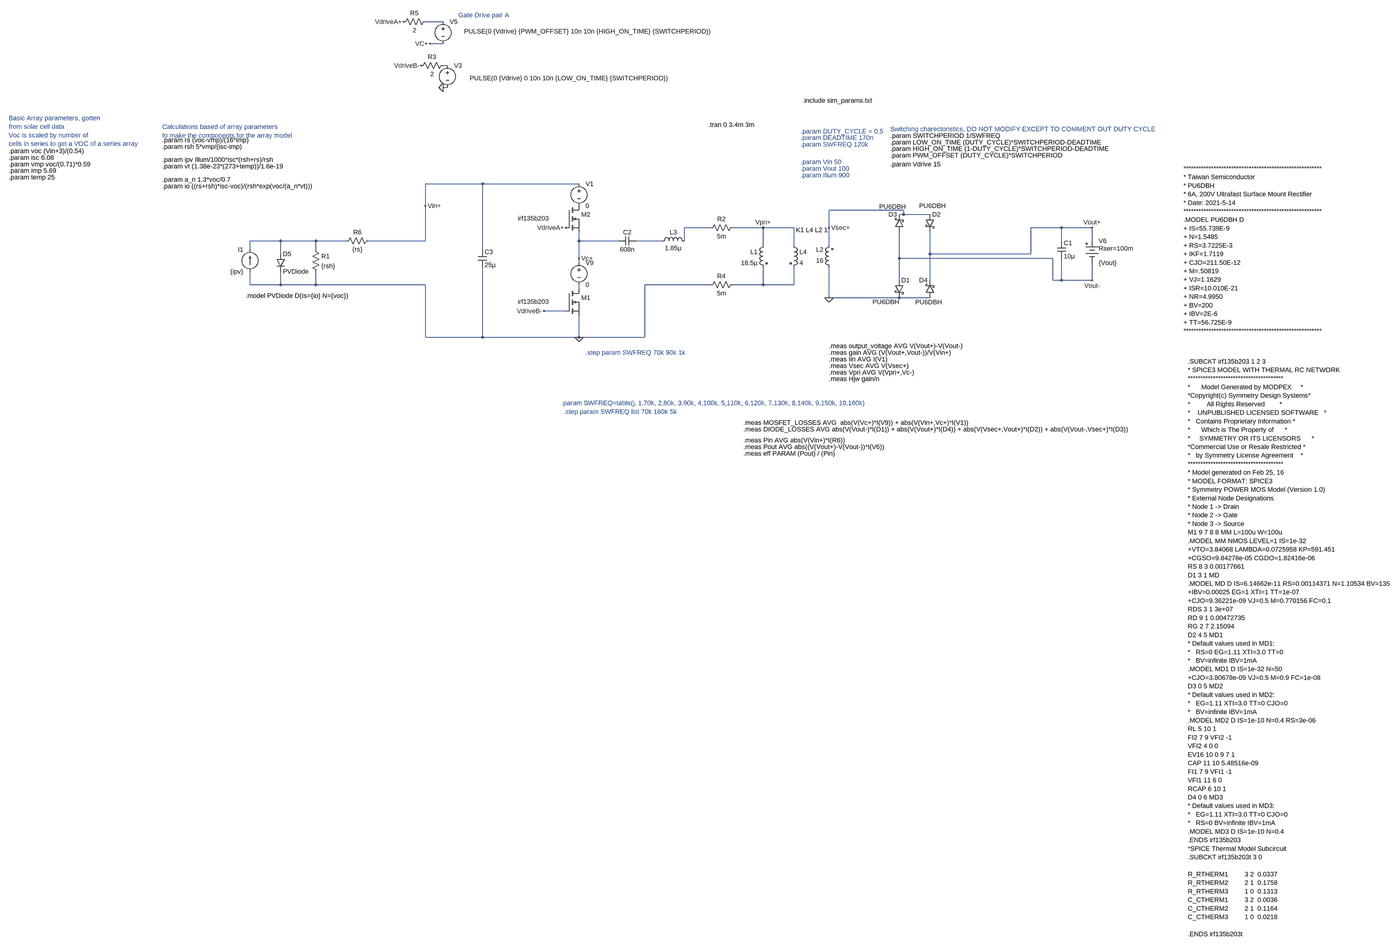
[diagram p0: schematic resonant_half_bridge.asc, whole sheet]
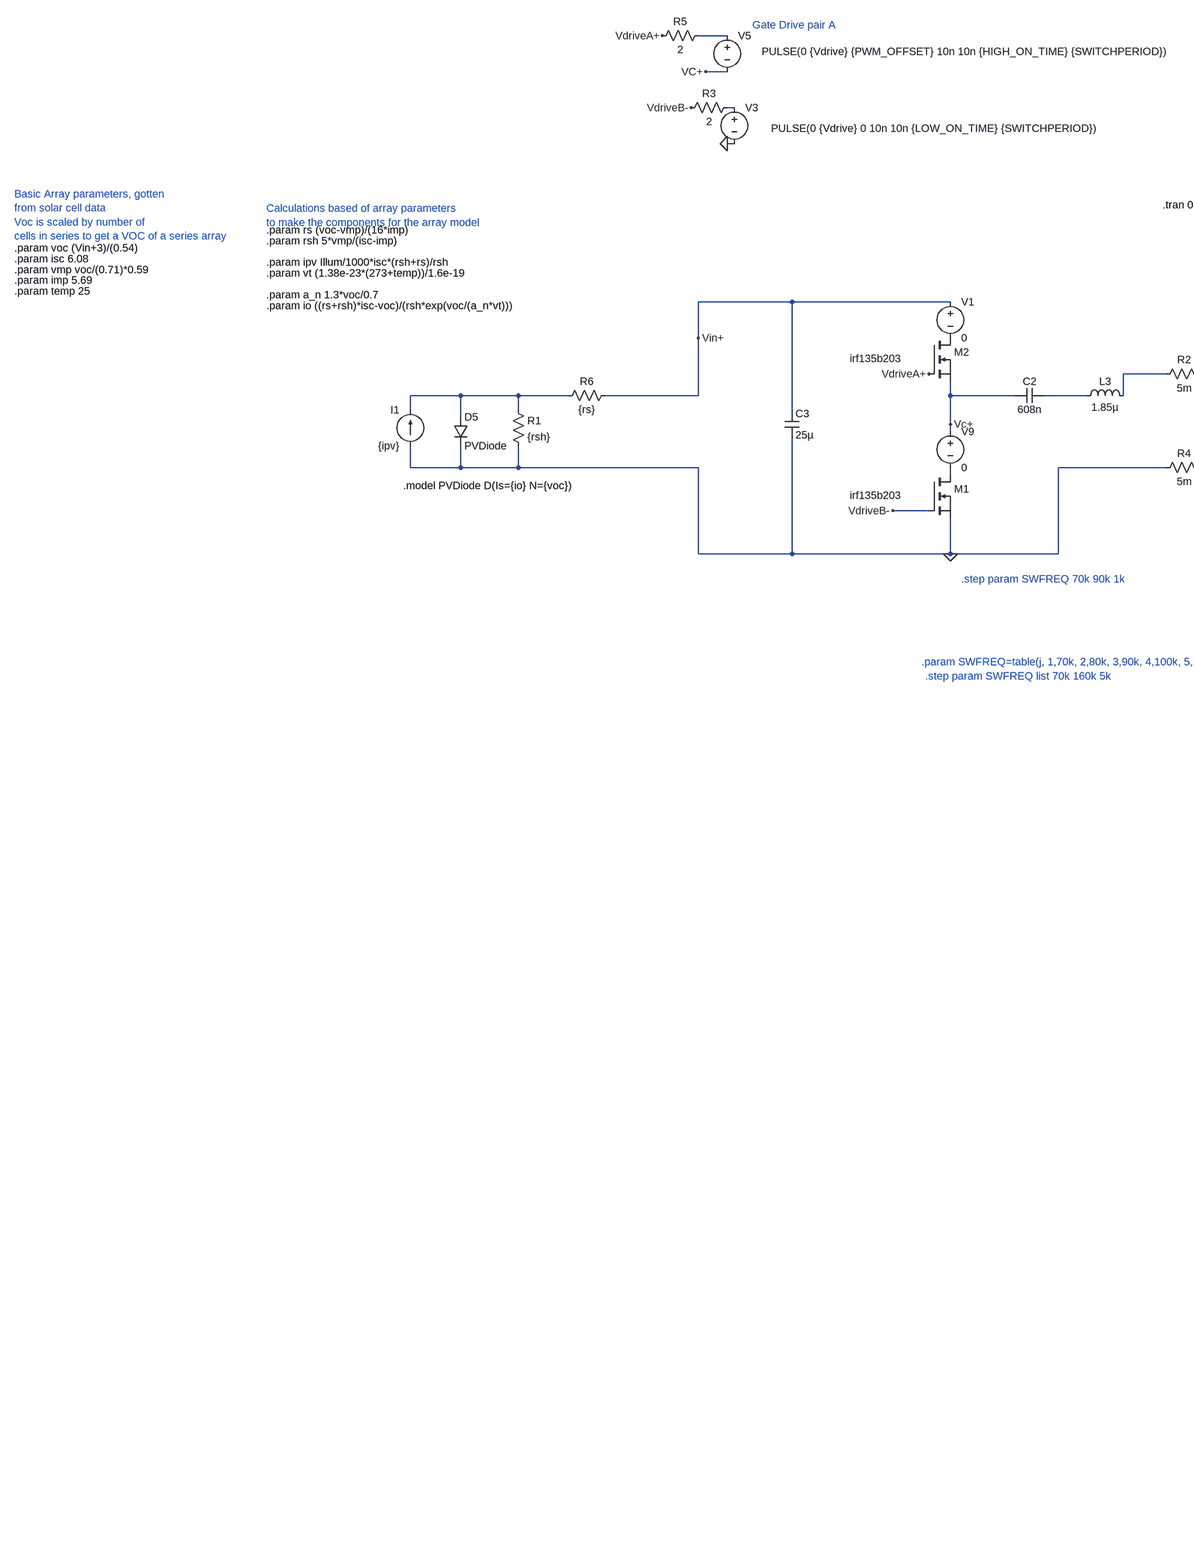
[diagram p1: schematic resonant_half_bridge.asc, part, row 1 of 1, column 1 of 2]
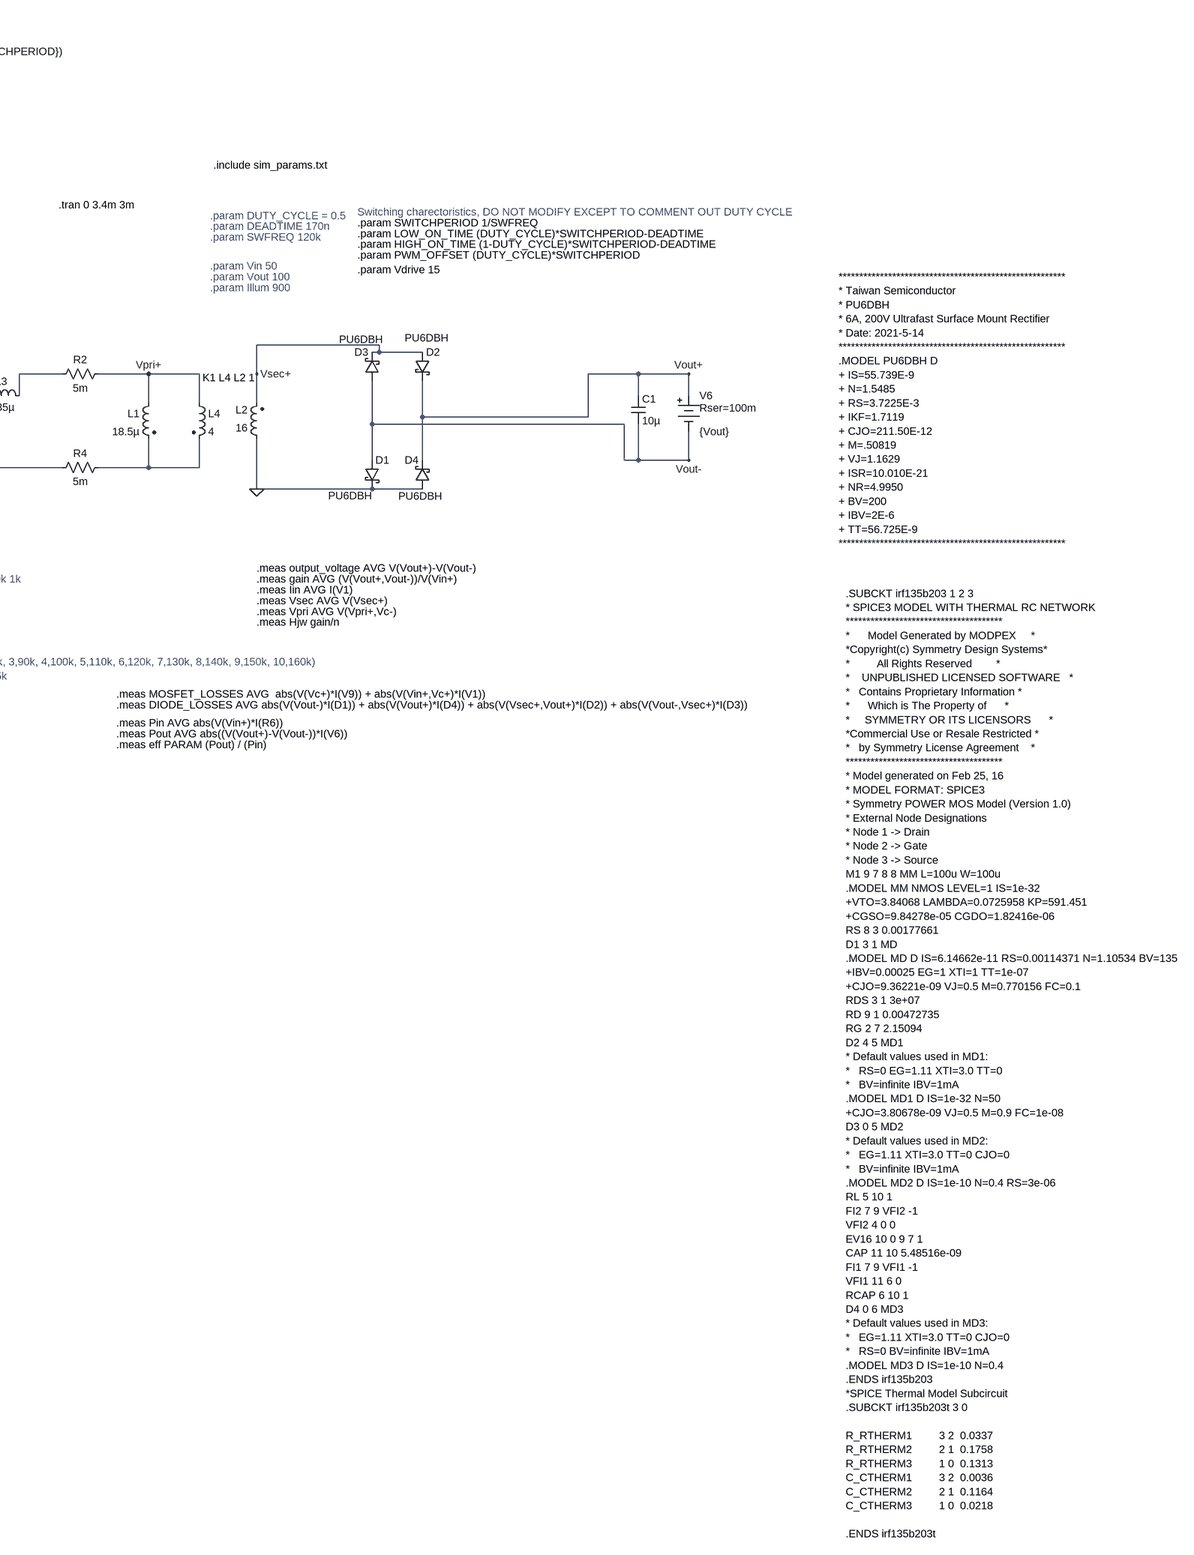
[diagram p2: schematic resonant_half_bridge.asc, part, row 1 of 1, column 2 of 2]
resonant_half_bridge.asc, the LTspice schematic file:
Version 4
SHEET 1 2776 1356
WIRE -1456 -1776 -1520 -1776
WIRE -1456 -1696 -1504 -1696
WIRE -1440 -1616 -1456 -1616
WIRE -1440 -1536 -1456 -1536
WIRE -1312 -1184 -1520 -1184
WIRE -960 -1184 -1312 -1184
WIRE -1520 -1104 -1520 -1184
WIRE 224 -1088 -48 -1088
WIRE 224 -1072 224 -1088
WIRE 224 -1072 208 -1072
WIRE 320 -1072 224 -1072
WIRE -480 -1024 -576 -1024
WIRE -288 -1024 -400 -1024
WIRE -176 -1024 -288 -1024
WIRE -48 -1024 -48 -1088
WIRE 800 -1024 688 -1024
WIRE 912 -1024 800 -1024
WIRE -2048 -976 -2160 -976
WIRE -1920 -976 -2048 -976
WIRE -1808 -976 -1920 -976
WIRE -1520 -976 -1520 -1104
WIRE -1520 -976 -1728 -976
WIRE -960 -976 -960 -1008
WIRE -816 -976 -960 -976
WIRE -656 -976 -752 -976
WIRE -576 -976 -576 -1024
WIRE 800 -976 800 -1024
WIRE 912 -976 912 -1024
WIRE -288 -960 -288 -1024
WIRE -176 -960 -176 -1024
WIRE -48 -960 -48 -1024
WIRE -2160 -944 -2160 -976
WIRE -1920 -944 -1920 -976
WIRE -1312 -944 -1312 -1184
WIRE -2048 -928 -2048 -976
WIRE 320 -928 320 -1008
WIRE 688 -928 688 -1024
WIRE 688 -928 320 -928
WIRE -960 -912 -960 -976
WIRE 208 -912 208 -1008
WIRE 768 -912 208 -912
WIRE -960 -896 -960 -912
WIRE 208 -832 208 -912
WIRE 320 -832 320 -928
WIRE 768 -832 768 -912
WIRE 800 -832 800 -912
WIRE 800 -832 768 -832
WIRE 912 -832 912 -896
WIRE 912 -832 800 -832
WIRE -2160 -816 -2160 -864
WIRE -2048 -816 -2048 -864
WIRE -2048 -816 -2160 -816
WIRE -1920 -816 -1920 -864
WIRE -1920 -816 -2048 -816
WIRE -1520 -816 -1920 -816
WIRE -480 -816 -720 -816
WIRE -288 -816 -288 -880
WIRE -288 -816 -400 -816
WIRE -176 -816 -176 -880
WIRE -176 -816 -288 -816
WIRE -960 -800 -960 -816
WIRE -48 -768 -48 -880
WIRE 208 -768 -48 -768
WIRE 320 -768 208 -768
WIRE -1008 -720 -1088 -720
WIRE -1520 -624 -1520 -816
WIRE -1312 -624 -1312 -880
WIRE -1312 -624 -1520 -624
WIRE -960 -624 -960 -704
WIRE -960 -624 -1312 -624
WIRE -720 -624 -720 -816
WIRE -720 -624 -960 -624
FLAG -48 -768 0
FLAG -1520 -1104 Vin+
FLAG 912 -1024 Vout+
FLAG 912 -832 Vout-
FLAG -960 -912 Vc+
FLAG -1008 -1024 VdriveA+
FLAG -1088 -720 VdriveB-
FLAG -1456 -1536 0
FLAG -1504 -1696 VC+
FLAG -1600 -1776 VdriveA+
FLAG -1536 -1616 VdriveB-
FLAG -48 -1024 Vsec+
FLAG -288 -1024 Vpri+
FLAG -960 -624 0
SYMBOL nmos -1008 -1104 R0
WINDOW 3 -175 46 Left 2
SYMATTR Value irf135b203
SYMATTR InstName M2
SYMATTR Prefix X
SYMBOL cap 784 -976 R0
SYMATTR InstName C1
SYMATTR Value 10µ
SYMBOL cap -816 -960 R270
WINDOW 0 32 32 VTop 2
WINDOW 3 0 32 VBottom 2
SYMATTR InstName C2
SYMATTR Value 608n
SYMBOL ind2 -272 -976 M0
SYMATTR InstName L1
SYMATTR Value 18.5µ
SYMATTR Type ind
SYMBOL ind2 -32 -864 R180
WINDOW 0 36 80 Left 2
WINDOW 3 36 40 Left 2
SYMATTR InstName L2
SYMATTR Value 16
SYMATTR Type ind
SYMBOL ind -672 -960 R270
WINDOW 0 32 56 VTop 2
WINDOW 3 5 56 VBottom 2
SYMATTR InstName L3
SYMATTR Value 1.85µ
SYMBOL voltage -1440 -1632 R0
WINDOW 3 82 62 Left 2
WINDOW 123 0 0 Left 0
WINDOW 39 0 0 Left 0
SYMATTR Value PULSE(0 {Vdrive} 0 10n 10n {LOW_ON_TIME} {SWITCHPERIOD})
SYMATTR InstName V3
SYMBOL nmos -1008 -800 R0
WINDOW 3 -175 46 Left 2
SYMATTR Value irf135b203
SYMATTR InstName M1
SYMATTR Prefix X
SYMBOL voltage -1456 -1792 R0
WINDOW 3 77 51 Left 2
WINDOW 123 0 0 Left 0
WINDOW 39 0 0 Left 0
SYMATTR Value PULSE(0 {Vdrive} {PWM_OFFSET} 10n 10n {HIGH_ON_TIME} {SWITCHPERIOD})
SYMATTR InstName V5
SYMBOL schottky 224 -1008 R180
WINDOW 3 -8 93 Left 2
WINDOW 0 24 64 Left 2
SYMATTR Value PU6DBH
SYMATTR InstName D3
SYMATTR Description Diode
SYMATTR Type diode
SYMATTR SpiceLine Bv=200
SYMBOL schottky 192 -832 R0
WINDOW 3 75 80 Left 2
SYMATTR Value PU6DBH
SYMATTR InstName D1
SYMATTR Description Diode
SYMATTR Type diode
SYMATTR SpiceLine Bv=200
SYMBOL schottky 304 -1072 R0
WINDOW 3 -23 -32 Left 2
SYMATTR Value PU6DBH
SYMATTR InstName D2
SYMATTR Description Diode
SYMATTR Type diode
SYMATTR SpiceLine Bv=200
SYMBOL schottky 336 -768 R180
WINDOW 3 128 -15 Left 2
WINDOW 0 24 64 Left 2
SYMATTR Value PU6DBH
SYMATTR InstName D4
SYMATTR Description Diode
SYMATTR Type diode
SYMATTR SpiceLine Bv=200
SYMBOL res -1440 -1632 R90
WINDOW 0 0 56 VBottom 2
WINDOW 3 32 56 VTop 2
SYMATTR InstName R3
SYMATTR Value 2
SYMBOL res -1504 -1792 R90
WINDOW 0 0 56 VBottom 2
WINDOW 3 32 56 VTop 2
SYMATTR InstName R5
SYMATTR Value 2
SYMBOL Misc\\battery 912 -992 R0
WINDOW 123 0 0 Left 0
WINDOW 39 24 44 Left 2
SYMATTR SpiceLine Rser=100m
SYMATTR InstName V6
SYMATTR Value {Vout}
SYMBOL res -1936 -960 R0
SYMATTR InstName R1
SYMATTR Value {rsh}
SYMBOL res -1824 -960 R270
WINDOW 0 32 56 VTop 2
WINDOW 3 0 56 VBottom 2
SYMATTR InstName R6
SYMATTR Value {rs}
SYMBOL current -2160 -864 R180
WINDOW 0 24 80 Left 2
WINDOW 3 24 0 Left 2
WINDOW 123 0 0 Left 0
WINDOW 39 0 0 Left 0
SYMATTR InstName I1
SYMATTR Value {ipv}
SYMBOL diode -2064 -928 R0
SYMATTR InstName D5
SYMATTR Value PVDiode
SYMBOL cap -1328 -944 R0
SYMATTR InstName C3
SYMATTR Value 25µ
SYMBOL voltage -960 -1200 R0
WINDOW 123 0 0 Left 0
WINDOW 39 0 0 Left 0
SYMATTR InstName V1
SYMATTR Value 0
SYMBOL voltage -960 -912 R0
WINDOW 123 0 0 Left 0
WINDOW 39 0 0 Left 0
SYMATTR InstName V9
SYMATTR Value 0
SYMBOL ind2 -192 -976 R0
SYMATTR InstName L4
SYMATTR Value 4
SYMATTR Type ind
SYMBOL res -496 -1008 R270
WINDOW 0 32 56 VTop 2
WINDOW 3 0 56 VBottom 2
SYMATTR InstName R2
SYMATTR Value 5m
SYMBOL res -384 -832 R90
WINDOW 0 0 56 VBottom 2
WINDOW 3 32 56 VTop 2
SYMATTR InstName R4
SYMATTR Value 5m
TEXT -152 -1352 Left 2 ;.param DEADTIME 170n
TEXT -152 -1328 Left 2 ;.param SWFREQ 120k
TEXT 176 -1360 Left 2 !.param SWITCHPERIOD 1/SWFREQ
TEXT 176 -1336 Left 2 !.param LOW_ON_TIME (DUTY_CYCLE)*SWITCHPERIOD-DEADTIME
TEXT 176 -1312 Left 2 !.param HIGH_ON_TIME (1-DUTY_CYCLE)*SWITCHPERIOD-DEADTIME
TEXT 176 -1288 Left 2 !.param PWM_OFFSET (DUTY_CYCLE)*SWITCHPERIOD
TEXT -152 -1264 Left 2 ;.param Vin 50
TEXT -152 -1376 Left 2 ;.param DUTY_CYCLE = 0.5
TEXT 176 -1384 Left 2 ;Switching charectoristics, DO NOT MODIFY EXCEPT TO COMMENT OUT DUTY CYCLE
TEXT -168 -1016 Left 2 !K1 L4 L2 1
TEXT 176 -1256 Left 2 !.param Vdrive 15
TEXT -488 -1400 Left 2 !.tran 0 3.4m 3m
TEXT -1016 -352 Left 2 ;.step param SWFREQ list 70k 160k 5k
TEXT -1024 -384 Left 2 ;.param SWFREQ=table(j, 1,70k, 2,80k, 3,90k, 4,100k, 5,110k, 6,120k, 7,130k, 8,140k, 9,150k, 10,160k)
TEXT -360 -248 Left 2 !.meas Pin AVG abs(V(Vin+)*I(R6))
TEXT -360 -224 Left 2 !.meas Pout AVG abs((V(Vout+)-V(Vout-))*I(V6))
TEXT -360 -200 Left 2 !.meas eff PARAM (Pout) / (Pin)
TEXT -1400 -1800 Left 2 ;Gate Drive pair A
TEXT -360 -288 Left 2 !.meas DIODE_LOSSES AVG abs(V(Vout-)*I(D1)) + abs(V(Vout+)*I(D4)) + abs(V(Vsec+,Vout+)*I(D2)) + abs(V(Vout-,Vsec+)*I(D3))
TEXT -360 -312 Left 2 !.meas MOSFET_LOSSES AVG  abs(V(Vc+)*I(V9)) + abs(V(Vin+,Vc+)*I(V1))
TEXT -48 -592 Left 2 !.meas output_voltage AVG V(Vout+)-V(Vout-)
TEXT -48 -568 Left 2 !.meas gain AVG (V(Vout+,Vout-))/V(Vin+)
TEXT -936 -568 Left 2 ;.step param SWFREQ 70k 90k 1k
TEXT -48 -544 Left 2 !.meas Iin AVG I(V1)
TEXT -48 -520 Left 2 !.meas Vsec AVG V(Vsec+)
TEXT -48 -496 Left 2 !.meas Vpri AVG V(Vpri+,Vc-)
TEXT -48 -472 Left 2 !.meas Hjw gain/n
TEXT -152 -1240 Left 2 ;.param Vout 100
TEXT -2480 -1344 Left 2 !.param rs (voc-vmp)/(16*imp)
TEXT -2480 -1320 Left 2 !.param rsh 5*vmp/(isc-imp)
TEXT -2480 -1176 Left 2 !.param io ((rs+rsh)*isc-voc)/(rsh*exp(voc/(a_n*vt)))
TEXT -2480 -1272 Left 2 !.param ipv Illum/1000*isc*(rsh+rs)/rsh
TEXT -2480 -1200 Left 2 !.param a_n 1.3*voc/0.7
TEXT -3040 -1304 Left 2 !.param voc (Vin+3)/(0.54)
TEXT -3040 -1280 Left 2 !.param isc 6.08
TEXT -3040 -1256 Left 2 !.param vmp voc/(0.71)*0.59
TEXT -3040 -1232 Left 2 !.param imp 5.69
TEXT -2480 -1248 Left 2 !.param vt (1.38e-23*(273+temp))/1.6e-19
TEXT -3040 -1208 Left 2 !.param temp 25
TEXT -3040 -1424 Left 2 ;Basic Array parameters, gotten\nfrom solar cell data\nVoc is scaled by number of\ncells in series to get a VOC of a series array
TEXT -2480 -1392 Left 2 ;Calculations based of array parameters \nto make the components for the array model
TEXT -2176 -776 Left 2 !.model PVDiode D(Is={io} N={voc})
TEXT -152 -1216 Left 2 ;.param Illum 900
TEXT 1400 -1240 Left 2 !*******************************************************\n* Taiwan Semiconductor\n* PU6DBH\n* 6A, 200V Ultrafast Surface Mount Rectifier\n* Date: 2021-5-14\n*******************************************************\n.MODEL PU6DBH D\n+ IS=55.739E-9\n+ N=1.5485\n+ RS=3.7225E-3\n+ IKF=1.7119\n+ CJO=211.50E-12\n+ M=.50819\n+ VJ=1.1629\n+ ISR=10.010E-21\n+ NR=4.9950\n+ BV=200\n+ IBV=2E-6\n+ TT=56.725E-9\n*******************************************************
TEXT 1416 -536 Left 2 !.SUBCKT irf135b203 1 2 3\n* SPICE3 MODEL WITH THERMAL RC NETWORK\n**************************************\n*      Model Generated by MODPEX     *\n*Copyright(c) Symmetry Design Systems*\n*         All Rights Reserved        *\n*    UNPUBLISHED LICENSED SOFTWARE   *\n*   Contains Proprietary Information *\n*      Which is The Property of      *\n*     SYMMETRY OR ITS LICENSORS      *\n*Commercial Use or Resale Restricted *\n*   by Symmetry License Agreement    *\n**************************************\n* Model generated on Feb 25, 16\n* MODEL FORMAT: SPICE3\n* Symmetry POWER MOS Model (Version 1.0)\n* External Node Designations\n* Node 1 -> Drain\n* Node 2 -> Gate\n* Node 3 -> Source\nM1 9 7 8 8 MM L=100u W=100u\n.MODEL MM NMOS LEVEL=1 IS=1e-32\n+VTO=3.84068 LAMBDA=0.0725958 KP=591.451\n+CGSO=9.84278e-05 CGDO=1.82416e-06\nRS 8 3 0.00177661\nD1 3 1 MD\n.MODEL MD D IS=6.14662e-11 RS=0.00114371 N=1.10534 BV=135\n+IBV=0.00025 EG=1 XTI=1 TT=1e-07\n+CJO=9.36221e-09 VJ=0.5 M=0.770156 FC=0.1\nRDS 3 1 3e+07\nRD 9 1 0.00472735\nRG 2 7 2.15094\nD2 4 5 MD1\n* Default values used in MD1:\n*   RS=0 EG=1.11 XTI=3.0 TT=0\n*   BV=infinite IBV=1mA\n.MODEL MD1 D IS=1e-32 N=50\n+CJO=3.80678e-09 VJ=0.5 M=0.9 FC=1e-08\nD3 0 5 MD2\n* Default values used in MD2:\n*   EG=1.11 XTI=3.0 TT=0 CJO=0\n*   BV=infinite IBV=1mA\n.MODEL MD2 D IS=1e-10 N=0.4 RS=3e-06\nRL 5 10 1\nFI2 7 9 VFI2 -1\nVFI2 4 0 0\nEV16 10 0 9 7 1\nCAP 11 10 5.48516e-09\nFI1 7 9 VFI1 -1\nVFI1 11 6 0\nRCAP 6 10 1\nD4 0 6 MD3\n* Default values used in MD3:\n*   EG=1.11 XTI=3.0 TT=0 CJO=0\n*   RS=0 BV=infinite IBV=1mA\n.MODEL MD3 D IS=1e-10 N=0.4\n.ENDS irf135b203\n*SPICE Thermal Model Subcircuit\n.SUBCKT irf135b203t 3 0\n \nR_RTHERM1         3 2  0.0337\nR_RTHERM2         2 1  0.1758\nR_RTHERM3         1 0  0.1313\nC_CTHERM1         3 2  0.0036\nC_CTHERM2         2 1  0.1164\nC_CTHERM3         1 0  0.0218\n \n.ENDS irf135b203t
TEXT -144 -1488 Left 2 !.include sim_params.txt

The netlist it stands for:
* resonant_half_bridge.asc
XM2 P001 VdriveA+ Vc+ irf135b203  ; pins D G S
C1 Vout+ Vout- 10µ
C2 Vc+ N005 608n
L1 Vpri+ N006 18.5µ
L2 0 Vsec+ 16
L3 N005 N003 1.85µ
V3 N002 0 PULSE(0 {Vdrive} 0 10n 10n {LOW_ON_TIME} {SWITCHPERIOD})
XM1 N007 VdriveB- 0 irf135b203  ; pins D G S
V5 N001 Vc+ PULSE(0 {Vdrive} {PWM_OFFSET} 10n 10n {HIGH_ON_TIME} {SWITCHPERIOD})
D3 Vout- Vsec+ PU6DBH Bv=200
D1 Vout- 0 PU6DBH Bv=200
D2 Vsec+ Vout+ PU6DBH Bv=200
D4 0 Vout+ PU6DBH Bv=200
R3 N002 VdriveB- 2
R5 N001 VdriveA+ 2
V6 Vout+ Vout- {Vout} Rser=100m
R1 N004 0 {rsh}
R6 N004 Vin+ {rs}
I1 0 N004 {ipv}
D5 N004 0 PVDiode
C3 Vin+ 0 25µ
V1 Vin+ P001 0
V9 Vc+ N007 0
L4 Vpri+ N006 4
R2 N003 Vpri+ 5m
R4 N006 0 5m
.model D D
.lib standard.dio
* .param DEADTIME 170n
* .param SWFREQ 120k
.param SWITCHPERIOD 1/SWFREQ
.param LOW_ON_TIME (DUTY_CYCLE)*SWITCHPERIOD-DEADTIME
.param HIGH_ON_TIME (1-DUTY_CYCLE)*SWITCHPERIOD-DEADTIME
.param PWM_OFFSET (DUTY_CYCLE)*SWITCHPERIOD
* .param Vin 50
* .param DUTY_CYCLE = 0.5
* Switching charectoristics, DO NOT MODIFY EXCEPT TO COMMENT OUT DUTY CYCLE
K1 L4 L2 1
.param Vdrive 15
.tran 0 3.4m 3m
* .step param SWFREQ list 70k 160k 5k
* .param SWFREQ=table(j, 1,70k, 2,80k, 3,90k, 4,100k, 5,110k, 6,120k, 7,130k, 8,140k, 9,150k, 10,160k)
.meas Pin AVG abs(V(Vin+)*I(R6))
.meas Pout AVG abs((V(Vout+)-V(Vout-))*I(V6))
.meas eff PARAM (Pout) / (Pin)
* Gate Drive pair A
.meas DIODE_LOSSES AVG abs(V(Vout-)*I(D1)) + abs(V(Vout+)*I(D4)) + abs(V(Vsec+,Vout+)*I(D2)) + abs(V(Vout-,Vsec+)*I(D3))
.meas MOSFET_LOSSES AVG  abs(V(Vc+)*I(V9)) + abs(V(Vin+,Vc+)*I(V1))
.meas output_voltage AVG V(Vout+)-V(Vout-)
.meas gain AVG (V(Vout+,Vout-))/V(Vin+)
* .step param SWFREQ 70k 90k 1k
.meas Iin AVG I(V1)
.meas Vsec AVG V(Vsec+)
.meas Vpri AVG V(Vpri+,Vc-)
.meas Hjw gain/n
* .param Vout 100
.param rs (voc-vmp)/(16*imp)
.param rsh 5*vmp/(isc-imp)
.param io ((rs+rsh)*isc-voc)/(rsh*exp(voc/(a_n*vt)))
.param ipv Illum/1000*isc*(rsh+rs)/rsh
.param a_n 1.3*voc/0.7
.param voc (Vin+3)/(0.54)
.param isc 6.08
.param vmp voc/(0.71)*0.59
.param imp 5.69
.param vt (1.38e-23*(273+temp))/1.6e-19
.param temp 25
* Basic Array parameters, gotten
* from solar cell data
* Voc is scaled by number of
* cells in series to get a VOC of a series array
* Calculations based of array parameters
* to make the components for the array model
.model PVDiode D(Is={io} N={voc})
* .param Illum 900
*******************************************************
* Taiwan Semiconductor
* PU6DBH
* 6A, 200V Ultrafast Surface Mount Rectifier
* Date: 2021-5-14
*******************************************************
.MODEL PU6DBH D
+ IS=55.739E-9
+ N=1.5485
+ RS=3.7225E-3
+ IKF=1.7119
+ CJO=211.50E-12
+ M=.50819
+ VJ=1.1629
+ ISR=10.010E-21
+ NR=4.9950
+ BV=200
+ IBV=2E-6
+ TT=56.725E-9
*******************************************************
.SUBCKT irf135b203 1 2 3
* SPICE3 MODEL WITH THERMAL RC NETWORK
**************************************
*      Model Generated by MODPEX     *
*Copyright(c) Symmetry Design Systems*
*         All Rights Reserved        *
*    UNPUBLISHED LICENSED SOFTWARE   *
*   Contains Proprietary Information *
*      Which is The Property of      *
*     SYMMETRY OR ITS LICENSORS      *
*Commercial Use or Resale Restricted *
*   by Symmetry License Agreement    *
**************************************
* Model generated on Feb 25, 16
* MODEL FORMAT: SPICE3
* Symmetry POWER MOS Model (Version 1.0)
* External Node Designations
* Node 1 -> Drain
* Node 2 -> Gate
* Node 3 -> Source
M1 9 7 8 8 MM L=100u W=100u
.MODEL MM NMOS LEVEL=1 IS=1e-32
+VTO=3.84068 LAMBDA=0.0725958 KP=591.451
+CGSO=9.84278e-05 CGDO=1.82416e-06
RS 8 3 0.00177661
D1 3 1 MD
.MODEL MD D IS=6.14662e-11 RS=0.00114371 N=1.10534 BV=135
+IBV=0.00025 EG=1 XTI=1 TT=1e-07
+CJO=9.36221e-09 VJ=0.5 M=0.770156 FC=0.1
RDS 3 1 3e+07
RD 9 1 0.00472735
RG 2 7 2.15094
D2 4 5 MD1
* Default values used in MD1:
*   RS=0 EG=1.11 XTI=3.0 TT=0
*   BV=infinite IBV=1mA
.MODEL MD1 D IS=1e-32 N=50
+CJO=3.80678e-09 VJ=0.5 M=0.9 FC=1e-08
D3 0 5 MD2
* Default values used in MD2:
*   EG=1.11 XTI=3.0 TT=0 CJO=0
*   BV=infinite IBV=1mA
.MODEL MD2 D IS=1e-10 N=0.4 RS=3e-06
RL 5 10 1
FI2 7 9 VFI2 -1
VFI2 4 0 0
EV16 10 0 9 7 1
CAP 11 10 5.48516e-09
FI1 7 9 VFI1 -1
VFI1 11 6 0
RCAP 6 10 1
D4 0 6 MD3
* Default values used in MD3:
*   EG=1.11 XTI=3.0 TT=0 CJO=0
*   RS=0 BV=infinite IBV=1mA
.MODEL MD3 D IS=1e-10 N=0.4
.ENDS irf135b203
*SPICE Thermal Model Subcircuit
.SUBCKT irf135b203t 3 0
R_RTHERM1         3 2  0.0337
R_RTHERM2         2 1  0.1758
R_RTHERM3         1 0  0.1313
C_CTHERM1         3 2  0.0036
C_CTHERM2         2 1  0.1164
C_CTHERM3         1 0  0.0218
.ENDS irf135b203t
.include sim_params.txt
.backanno
.end